# EAGLE design sloth_final (EAGLE 7.6.0)
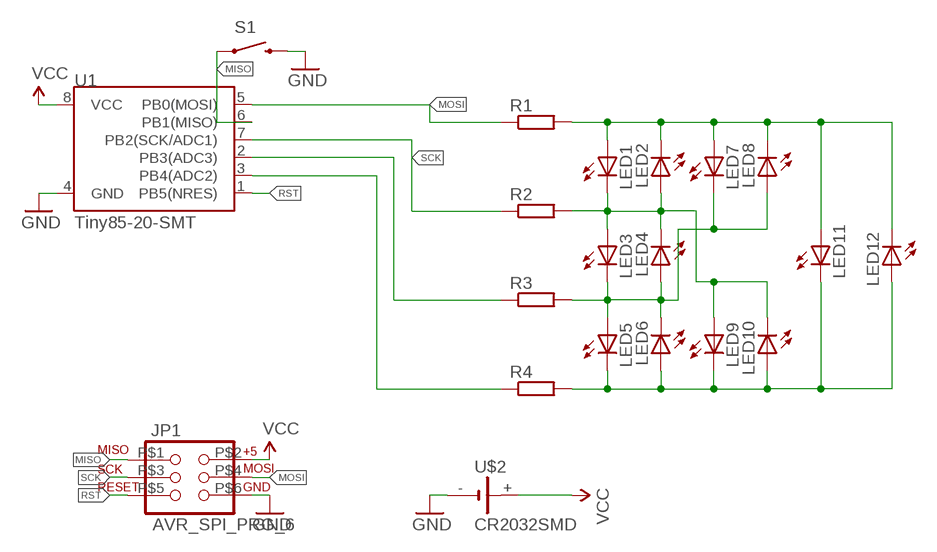
[diagram p0: schematic, sheet 1]

## Parts
JP1  AVR_SPI_PRG_6  [2X3_SMD_PAD]
LED1  LEDCHIP-LED0805  [CHIP-LED0805]
LED2  LEDCHIP-LED0805  [CHIP-LED0805]
LED3  LEDCHIP-LED0805  [CHIP-LED0805]
LED4  LEDCHIP-LED0805  [CHIP-LED0805]
LED5  LEDCHIP-LED0805  [CHIP-LED0805]
LED6  LEDCHIP-LED0805  [CHIP-LED0805]
LED7  LEDCHIP-LED0805  [CHIP-LED0805]
LED8  LEDCHIP-LED0805  [CHIP-LED0805]
LED9  LEDCHIP-LED0805  [CHIP-LED0805]
LED10  LEDCHIP-LED0805  [CHIP-LED0805]
LED11  LEDCHIP-LED0805  [CHIP-LED0805]
LED12  LEDCHIP-LED0805  [CHIP-LED0805]
R1  R-EU_R0805  [R0805]
R2  R-EU_R0805  [R0805]
R3  R-EU_R0805  [R0805]
R4  R-EU_R0805  [R0805]
S1  SWITCH-MOMENTARY-2-SMD-1101NE  [TACTILE-SWITCH-1101NE]
U1  Tiny85-20-SMT  ATTINY45TINY85-20-SMT  [SO08-EIAJ]
U$2  CR2032SMD  [CR2032SMD]

## Nets
GND: JP1.P$6 S1.P$2 U1.4(GND) U$2.-
MISO: JP1.P$1 S1.P$1 U1.6(PB1(MISO))
MOSI: JP1.P$4 R1.1 U1.5(PB0(MOSI))
N$1: R4.1 U1.3(PB4(ADC2))
N$2: LED5.C LED6.A LED9.C LED10.A LED11.C LED12.A R4.2
N$9: LED1.A LED2.C LED7.A LED8.C LED11.A LED12.C R1.2
N$11: LED1.C LED2.A LED3.A LED4.C LED9.A LED10.C R2.2
N$12: LED3.C LED4.A LED5.A LED6.C LED7.C LED8.A R3.2
PB3: R3.1 U1.2(PB3(ADC3))
RST: JP1.P$5 U1.1(PB5(NRES))
SCK: JP1.P$3 R2.1 U1.7(PB2(SCK/ADC1))
VCC: JP1.P$2 U1.8(VCC) U$2.+

## Library data of the parts
JP1 = SparkFun-Connectors:AVR_SPI_PRG_6: AVR ISP 6 Pin This is the reduced ISP connector for AVR programming. Common on Arduino. This footprint will take up less PCB space and can be used with a 10-pin to 6-pin adapter such as SKU: BOB-08508 **Special note about "TEST_POINT" package. The stop mask is on the top side, so if you want your programming test points to be on the bottom of your board, make sure to place this package on the bottom side of the board. This also ensure that the orientation to program from the bottom side will be correct.
LED1-LED12 = led:LED: LED OSRAM: - CHIPLED LG R971, LG N971, LY N971, LG Q971, LY Q971, LO R971, LY R971 LH N974, LH R974 LS Q976, LO Q976, LY Q976 LO Q996 - Hyper CHIPLED LW Q18S LB Q993, LB Q99A, LB R99A - SideLED LS A670, LO A670, LY A670, LG A670, LP A670 LB A673, LV A673, LT A673, LW A673 LH A674 LY A675 LS A676, LA A676, LO A676, LY A676, LW A676 LS A679, LY A679, LG A679 - Hyper Micro SIDELED® LS Y876, LA Y876, LO Y876, LY Y876 LT Y87S - SmartLED LW L88C, LW L88S LB L89C, LB L89S, LG L890 LS L89K, LO L89K, LY L89K LS L896, LA L896, LO L896, LY L896 - TOPLED LS T670, LO T670, LY T670, LG T670, LP T670 LSG T670, LSP T670, LSY T670, LOP T670, LYG T670 LG T671, LOG T671, LSG T671 LB T673, LV T673, LT T673, LW T673 LH T674 LS T676, LA T676, LO T676, LY T676, LB T676, LH T676, LSB T676, LW T676 LB T67C, LV T67C, LT T67C, LS T67K, LO T67K, LY T67K, LW E67C LS E67B, LA E67B, LO E67B, LY E67B, LB E67C, LV E67C, LT E67C LW T67C LS T679, LY T679, LG T679 LS T770, LO T770, LY T770, LG T770, LP T770 LB T773, LV T773, LT T773, LW T773 LH T774 LS E675, LA E675, LY E675, LS T675 LS T776, LA T776, LO T776, LY T776, LB T776 LHGB T686 LT T68C, LB T68C - Hyper Mini TOPLED® LB M676 - Mini TOPLED Santana® LG M470 LS M47K, LO M47K, LY M47K Source: http://www.osram.convergy.de LUXEON: - LUMILED® LXK2-PW12-R00, LXK2-PW12-S00, LXK2-PW14-U00, LXK2-PW14-V00 LXK2-PM12-R00, LXK2-PM12-S00, LXK2-PM14-U00 LXK2-PE12-Q00, LXK2-PE12-R00, LXK2-PE12-S00, LXK2-PE14-T00, LXK2-PE14-U00 LXK2-PB12-K00, LXK2-PB12-L00, LXK2-PB12-M00, LXK2-PB14-N00, LXK2-PB14-P00, LXK2-PB14-Q00 LXK2-PR12-L00, LXK2-PR12-M00, LXK2-PR14-Q00, LXK2-PR14-R00 LXK2-PD12-Q00, LXK2-PD12-R00, LXK2-PD12-S00 LXK2-PH12-R00, LXK2-PH12-S00 LXK2-PL12-P00, LXK2-PL12-Q00, LXK2-PL12-R00 Source: www.luxeon.com KINGBRIGHT: KA-3528ASYC Source: www.kingbright.com
R1-R4 = rcl:R-EU_: RESISTOR, European symbol
S1 = SparkFun-Electromechanical:SWITCH-MOMENTARY-2: Various NO switches- pushbuttons, reed, etc
U1 = SparkFun-DigitalIC:ATTINY45: Atmel 8-pin 2/4/8kB flash uC; PROD_ID: IC-09092
U$2 = battery:CR2032SMD

## Board
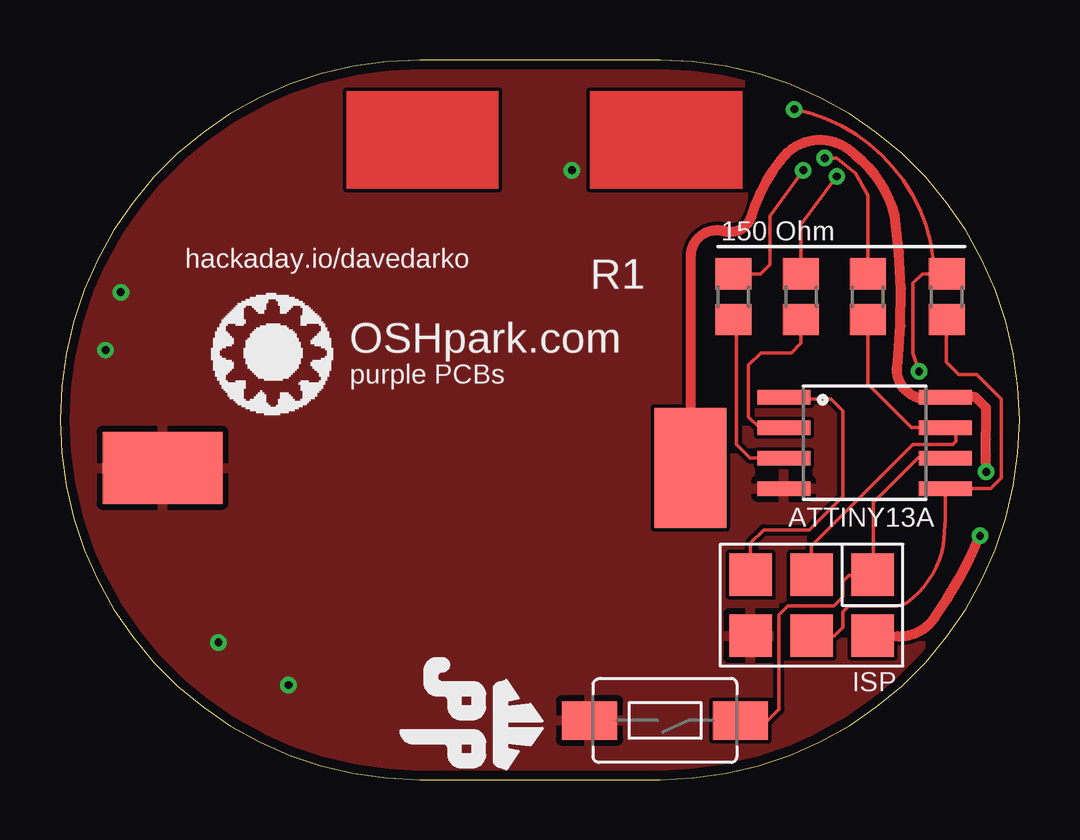
[diagram p1: board, top side]
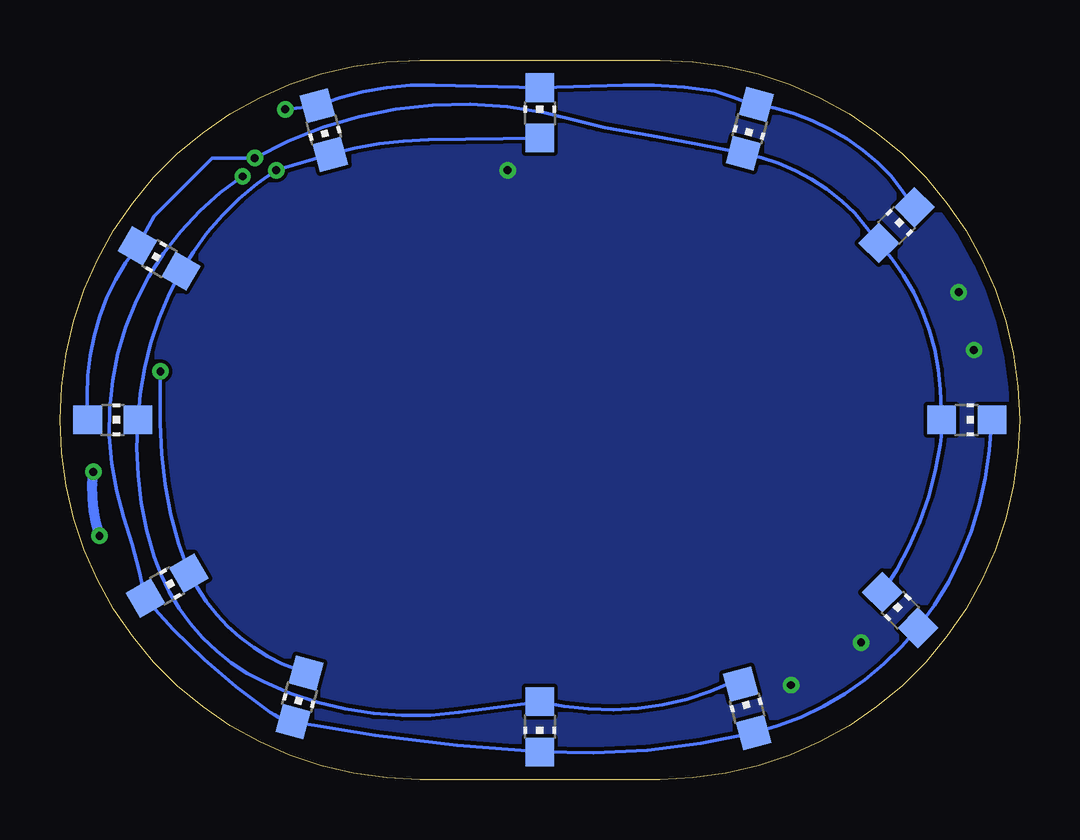
[diagram p2: board, bottom side, seen from below]

Size 40 x 30 mm. Coordinates in mm from the lower left corner, seen from the top.
Outline: 0,15 arc90 15,0 25,0 arc90 40,15 arc90 25,30 15,30 arc90 0,15
Copper layers (1*16): Top 0.0356mm / dielectric 1.5011mm / Bottom 0.0356mm
Design rules "LaenPCBOrder *": minimum track width 6mil, minimum drill 13mil, track to track 6mil, track to pad 6mil, pad to pad 6mil, via to via 6mil, smd to smd 6mil, copper to edge 15mil, drill to drill 6mil, minimum pad ring 7mil, minimum via ring 7mil, stop-mask expansion 3mil, vias tented up to drill 200mil, thermal gap 10mil

### Footprints (pad centres in the part's own frame; a part is rotated, then mirrored left to right if it is on the bottom)
2X3_SMD_PAD = smd 1.778 x 1.778: P$1 -1.27,2.54; P$2 1.27,2.54; P$3 -1.27,0; P$4 1.27,0; P$5 -1.27,-2.54; P$6 1.27,-2.54
CHIP-LED0805 = smd 1.2 x 1.2: A 0,-1.05; C 0,1.05
R0805 = smd 1.3 x 1.5: 1 -0.95,0; 2 0.95,0
TACTILE-SWITCH-1101NE = smd 2.3 x 1.6: P$1 -3.15,0; P$2 3.15,0
SO08-EIAJ = smd 0.61 x 2.21: 1 -1.905,-3.378; 2 -0.635,-3.378; 3 0.635,-3.378; 4 1.905,-3.378; 5 1.905,3.353; 6 0.635,3.353; 7 -0.635,3.353; 8 -1.905,3.353
CR2032SMD = smd 5 x 3: + 0,-11 | smd 3 x 5: - 0,11

### Placement (x,y rotation side)
JP1  31.33,7.27 270 top
LED1  11.24,27.13 165 bottom
LED2  5.12,23.11 315 bottom
LED3  2.2,15 270 bottom
LED4  4.98,7.07 45 bottom
LED5  11.35,2.97 15 bottom
LED6  20,2.2 180 bottom
LED7  30.01,3.43 165 bottom
LED8  35.53,8.08 300 bottom
LED9  37.8,15 270 bottom
LED10  35.86,21.72 60 bottom
LED11  29,27.08 195 bottom
LED12  20,27.8 0 bottom
R1  36.97,20.13 90 top
R2  33.67,20.13 90 top
R3  30.89,20.13 90 top
R4  28.07,20.13 90 top
S1  25.22,2.47 180 top
U1  33.55,14.03 270 top
U$1  [DAVEDARKO2_LOGO]  17.91,2.29 90 top
U$2  15.28,12.99 90 top
U$3  [OSHPARK_LOGO]  17.78,17.78 0 top

### Tracks (layer width: path | path; a pad name or v marks a point on that pad's centre or on a via)
GND  (via drill 0.33)
  other vias: 2.54,20.32 1.91,17.91 6.6,5.71 9.53,3.94 21.34,25.4
  pour Bottom (isolate 0.152): -1,31 41,31 41,-1 -1,-1
  pour Top (isolate 0.152): 0,33.02 40.64,33.02 40.64,-2.54 0,-2.54
MISO
  Top 0.152: U1.6 35.75,13.4 33.91,11.56 33.91,8.58 JP1.P$1 33.84,8.51 32.89,8.51 32.64,8.26 32.64,7.62 32.26,7.24 30.35,7.24 29.97,6.86 29.97,2.92 29.52,2.47 S1.P$1
MOSI
  Top 0.152: R1.1 36.96,19.17 36.96,17.4 37.47,16.89 38.23,16.89 39.24,15.88 39.24,12.57 38.8,12.13 U1.5 36.9,10.87 36.83,9.78 arc-42 35.31,7.37 34.92,7.24 32.89,7.24 32.64,6.99 32.64,6.35 32.29,6 JP1.P$4
N$1
  Top 0.152: R4.1 28.19,19.06 28.19,13.97 28.77,13.4 U1.3
N$2  (via drill 0.33)
  Top 0.152: R4.2 29.21,21.08 29.59,21.46 29.59,23.5 v30.99,25.4
  Bottom 0.152: LED5.C 11.94,4.06 arc38 LED6.A 23.37,2.79 arc33 31.5,4.06 arc46 36.07,9.27 arc23 LED9.C arc27 LED10.A arc27 v30.99,25.4 LED11.C arc15 24.64,26.67 LED12.A
N$9  (via drill 0.33)
  Top 0.152: v30.61,27.94 arc-77 36.45,21.08 R1.2 36.46,21.08 35.94,21.08 35.56,20.7 35.56,17.78 arc2 v35.81,17.02
  Bottom 0.152: LED2.C 5.33,25.15 arc-39 LED1.A arc11 11.94,28.45 12.7,28.7 arc-11 16.51,28.96 LED12.C 24.38,28.96 arc-23 LED11.A arc3 v30.61,27.94 | LED7.A 30.73,4.83 arc39 LED8.C | LED8.C 34.67,8.64 | v35.81,17.02 35.81,14.86 arc-22 LED8.C
N$11  (via drill 0.33)
  Top 0.152: R2.2 33.67,24.36 33.15,25.27 32.38,25.91 v31.88,25.91
  Bottom 0.152: LED4.C arc-27 3.3,13.97 arc-11 LED3.A 3.3,16.26 arc-39 LED2.A 6.86,23.62 arc-34 LED1.C arc-2 17.27,27.18 arc4 18.29,27.43 arc-46 v31.88,25.91 33.66,25.91 36.07,23.5 LED10.C arc-38 38.86,16 LED9.A
N$12  (via drill 0.33)
  Top 0.152: v32.38,25.15 30.89,23.14 R3.2
  Bottom 0.152: LED3.C 1.27,13.72 arc33 LED4.A arc38 LED5.A arc17 LED6.C arc8 LED7.C arc22 31.24,2.79 arc14 LED8.A arc-6 37.34,10.92 arc74 v32.38,25.15
PB3
  Top 0.152: R3.1 30.89,18.19 30.48,17.78 29.21,17.78 28.7,17.27 28.7,15.11 29.15,14.67 U1.2
RST
  Top 0.152: JP1.P$5 28.79,9.87 29.34,10.41 31.24,10.41 32.64,11.81 32.64,15.37 32.13,15.88 30.61,15.88 U1.1
SCK
  Top 0.152: R2.1 33.67,16.49 35.5,14.67 U1.7 37.34,14.61 37.34,14.1 37.21,13.97 35.56,13.97 31.33,9.74 JP1.P$3
VCC  (via drill 0.33)
  Top 0.406: U$2.+ 26.29,21.72 arc-110 27.69,22.86 arc90 28.83,23.5 arc-27 30.35,26.16 arc-87 33.15,26.04 arc-38 34.8,23.5 arc-15 34.92,17.4 arc95 35.94,15.88 U1.8 38.16,15.94 38.61,15.49 38.61,14.86 arc2 v38.61,12.83 | JP1.P$2 34.92,5.97 arc56 36.45,6.73 arc12 v38.35,10.16
  Bottom 0.406: v38.35,10.16 arc24 v38.61,12.83
(copper drawn outside any net)
  shapes: Top area x2

### Text on the board
tNames: 150 Ohm | hackaday.io/davedarko | R1 | ATTINY13A | ISP